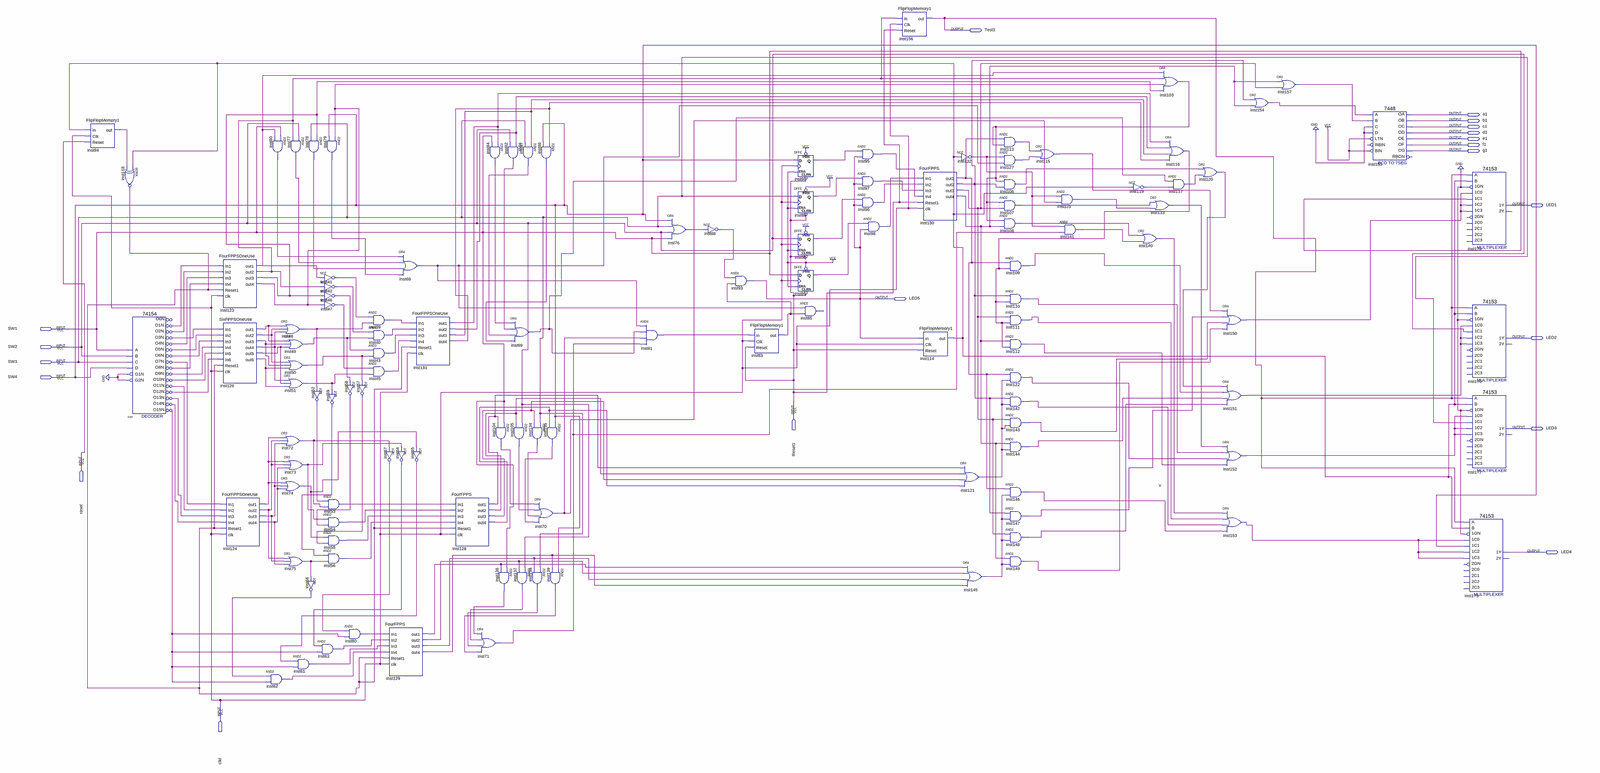
[diagram p0: schematic sheet, whole]
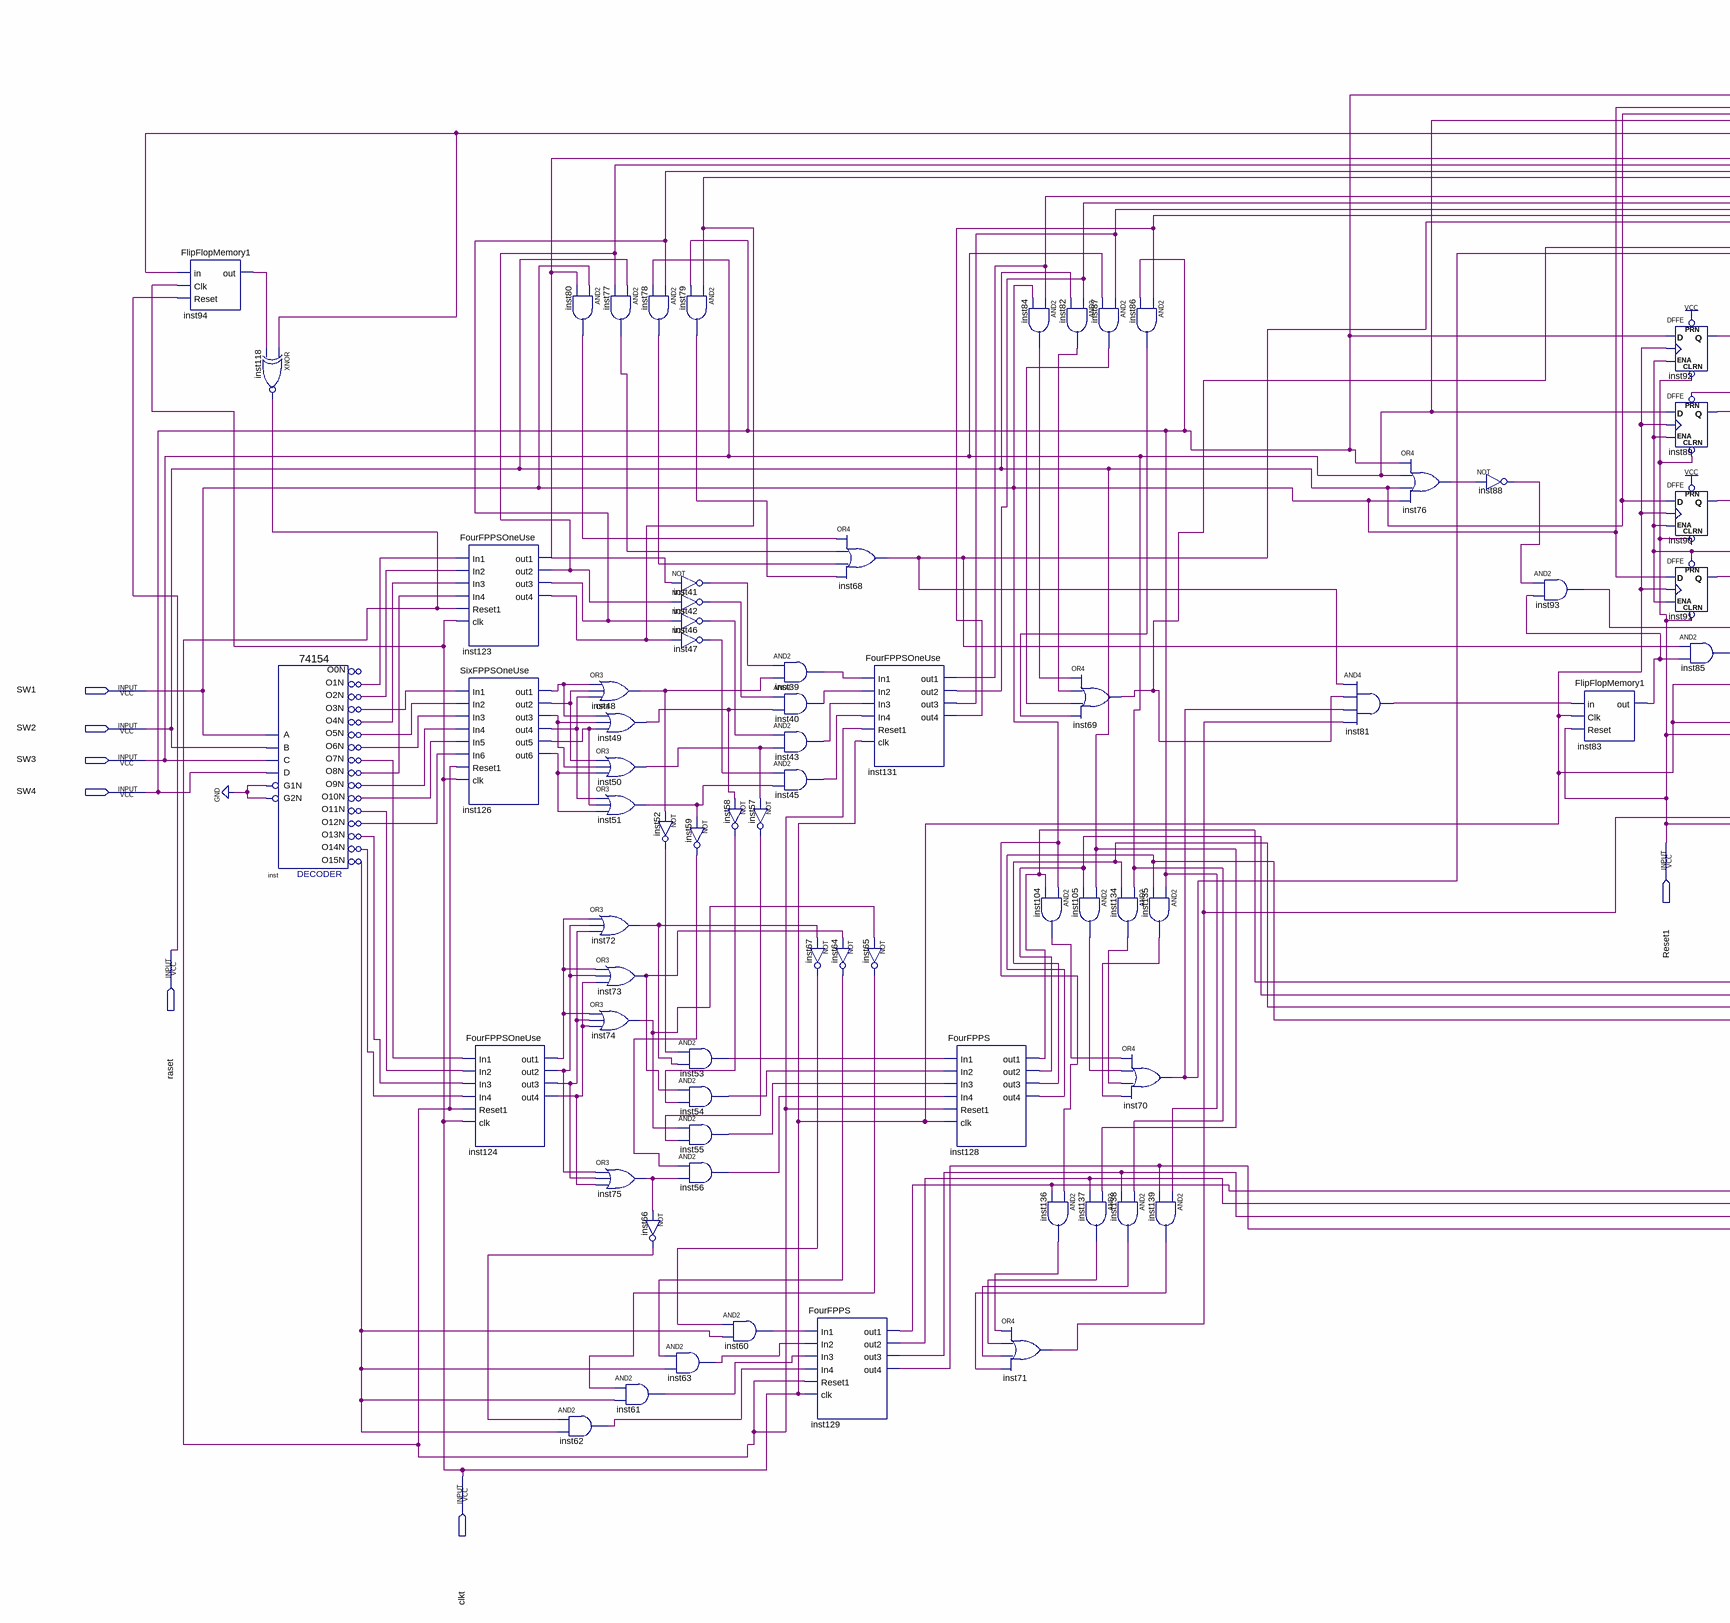
[diagram p1: schematic sheet, left part]
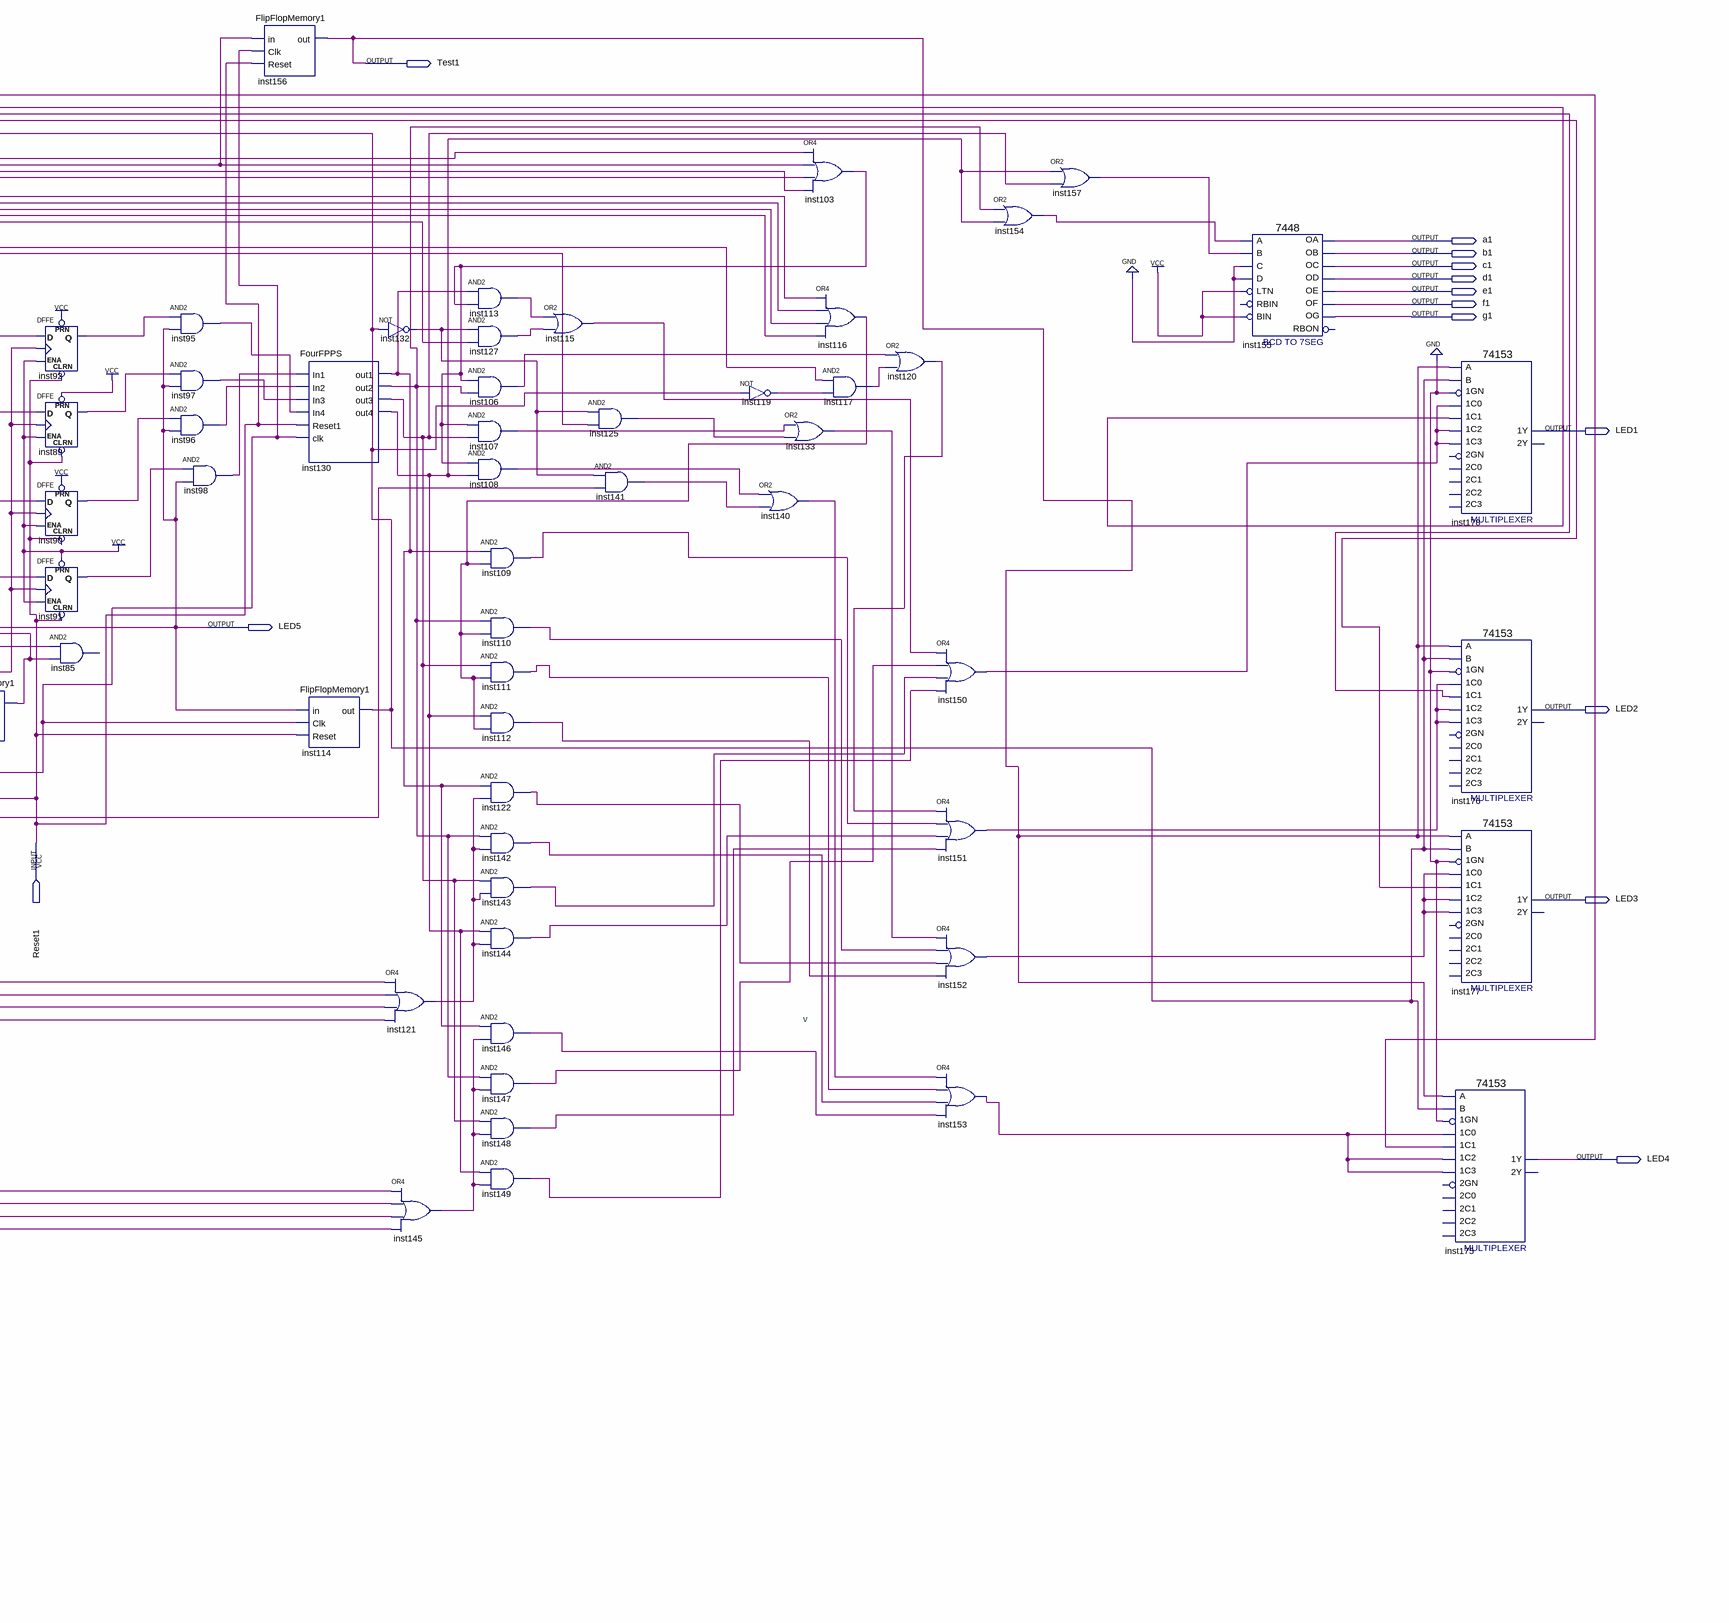
[diagram p2: schematic sheet, right part]
// Quartus schematic TR1.bdf as structural Verilog: 119 symbols, 20 pins
module TR1 (
  input  SW1,
  input  SW2,
  input  SW3,
  input  SW4,
  input  Reset1,
  input  raset,
  input  clkt,
  output Test1,
  output a1,
  output b1,
  output c1,
  output d1,
  output e1,
  output f1,
  output g1,
  output LED1,
  output LED5,
  output LED2,
  output LED3,
  output LED4
);

  wire inst39_out, inst40_out, inst41_out, inst42_out, inst43_out, inst45_out, inst46_out, inst47_out,
       inst48_out, inst49_out, inst50_out, inst51_out, inst52_out, inst53_out, inst54_out, inst55_out,
       inst56_out, inst57_out, inst58_out, inst59_out, inst60_out, inst61_out, inst62_out, inst63_out,
       inst64_out, inst65_out, inst66_out, inst67_out, inst68_out, inst69_out, inst70_out, inst71_out,
       inst72_out, inst73_out, inst74_out, inst75_out, inst76_out, inst77_out, inst78_out, inst79_out,
       inst80_out, inst81_out, inst82_out, inst83_out, inst84_out, inst86_out, inst87_out, inst88_out,
       inst89_q, inst90_q, inst91_q, inst92_q, inst94_out, inst95_out, inst96_out, inst97_out, inst98_out,
       inst103_out, inst104_out, inst105_out, inst106_out, inst107_out, inst108_out, inst109_out,
       inst110_out, inst111_out, inst112_out, inst113_out, inst114_out, inst115_out, inst116_out,
       inst117_out, inst118_out, inst119_out, inst120_out, inst121_out, inst122_out, inst123_out1,
       inst123_out2, inst123_out3, inst123_out4, inst124_out1, inst124_out2, inst124_out3, inst124_out4,
       inst125_out, inst126_out1, inst126_out2, inst126_out3, inst126_out4, inst126_out5, inst126_out6,
       inst127_out, inst128_out1, inst128_out2, inst128_out3, inst128_out4, inst129_out1, inst129_out2,
       inst129_out3, inst129_out4, inst130_out1, inst130_out2, inst130_out3, inst130_out4, inst131_out1,
       inst131_out2, inst131_out3, inst131_out4, inst132_out, inst133_out, inst134_out, inst135_out,
       inst136_out, inst137_out, inst138_out, inst139_out, inst140_out, inst141_out, inst142_out,
       inst143_out, inst144_out, inst145_out, inst146_out, inst147_out, inst148_out, inst149_out,
       inst150_out, inst151_out, inst152_out, inst153_out, inst154_out, inst157_out, inst_o1n,
       inst_O1N_inverted_out, inst_o2n, inst_O2N_inverted_out, inst_o3n, inst_O3N_inverted_out, inst_o4n,
       inst_O4N_inverted_out, inst_o5n, inst_O5N_inverted_out, inst_o6n, inst_O6N_inverted_out, inst_o7n,
       inst_O7N_inverted_out, inst_o8n, inst_O8N_inverted_out, inst_o9n, inst_O9N_inverted_out, inst_o10n,
       inst_O10N_inverted_out, inst_o11n, inst_O11N_inverted_out, inst_o12n, inst_O12N_inverted_out,
       inst_o13n, inst_O13N_inverted_out, inst_o14n, inst_O14N_inverted_out, inst_o15n,
       inst_O15N_inverted_out;

  FlipFlopMemory1 inst94 (.in(inst114_out), .Clk(clkt), .Reset(raset), .out(inst94_out));
  xnor inst118 (inst118_out, inst114_out, inst94_out);
  \74154  inst (
    .C(SW3), .D(SW4), .B(SW2), .A(SW1), .G1N(1'b0), .G2N(1'b0), .O12N(inst_o12n), .O15N(inst_o15n),
    .O10N(inst_o10n), .O11N(inst_o11n), .O1N(inst_o1n), .O13N(inst_o13n), .O14N(inst_o14n), .O4N(inst_o4n),
    .O3N(inst_o3n), .O2N(inst_o2n), .O7N(inst_o7n), .O6N(inst_o6n), .O5N(inst_o5n), .O9N(inst_o9n),
    .O8N(inst_o8n));  // open: O0N
  not inst_O12N_inverted (inst_O12N_inverted_out, inst_o12n);
  not inst_O15N_inverted (inst_O15N_inverted_out, inst_o15n);
  not inst_O10N_inverted (inst_O10N_inverted_out, inst_o10n);
  not inst_O11N_inverted (inst_O11N_inverted_out, inst_o11n);
  not inst_O1N_inverted (inst_O1N_inverted_out, inst_o1n);
  not inst_O13N_inverted (inst_O13N_inverted_out, inst_o13n);
  not inst_O14N_inverted (inst_O14N_inverted_out, inst_o14n);
  not inst_O4N_inverted (inst_O4N_inverted_out, inst_o4n);
  not inst_O3N_inverted (inst_O3N_inverted_out, inst_o3n);
  not inst_O2N_inverted (inst_O2N_inverted_out, inst_o2n);
  not inst_O7N_inverted (inst_O7N_inverted_out, inst_o7n);
  not inst_O6N_inverted (inst_O6N_inverted_out, inst_o6n);
  not inst_O5N_inverted (inst_O5N_inverted_out, inst_o5n);
  not inst_O9N_inverted (inst_O9N_inverted_out, inst_o9n);
  not inst_O8N_inverted (inst_O8N_inverted_out, inst_o8n);
  FourFPPSOneUse inst123 (
    .In1(inst_O1N_inverted_out), .In2(inst_O2N_inverted_out), .In3(inst_O4N_inverted_out),
    .In4(inst_O8N_inverted_out), .Reset1(inst118_out), .clk(clkt), .out1(inst123_out1), .out2(inst123_out2),
    .out3(inst123_out3), .out4(inst123_out4));
  SixFPPSOneUse inst126 (
    .In1(inst_O3N_inverted_out), .In2(inst_O5N_inverted_out), .In3(inst_O6N_inverted_out),
    .In4(inst_O9N_inverted_out), .In5(inst_O10N_inverted_out), .In6(inst_O12N_inverted_out),
    .Reset1(inst118_out), .clk(clkt), .out1(inst126_out1), .out2(inst126_out2), .out3(inst126_out3),
    .out4(inst126_out4), .out5(inst126_out5), .out6(inst126_out6));
  FourFPPSOneUse inst124 (
    .In1(inst_O7N_inverted_out), .In2(inst_O11N_inverted_out), .In3(inst_O13N_inverted_out),
    .In4(inst_O14N_inverted_out), .Reset1(inst118_out), .clk(clkt), .out1(inst124_out1), .out2(inst124_out2),
    .out3(inst124_out3), .out4(inst124_out4));
  and inst80 (inst80_out, SW1, inst123_out1);
  and inst62 (inst62_out, inst66_out, inst_O15N_inverted_out);
  and inst77 (inst77_out, SW2, inst123_out2);
  or inst48 (inst48_out, inst126_out1, inst126_out2, inst126_out4);
  or inst49 (inst49_out, inst126_out1, inst126_out3, inst126_out5);
  or inst50 (inst50_out, inst126_out2, inst126_out3, inst126_out6);
  or inst51 (inst51_out, inst126_out4, inst126_out5, inst126_out6);
  or inst72 (inst72_out, inst124_out1, inst124_out2, inst124_out3);
  or inst73 (inst73_out, inst124_out1, inst124_out2, inst124_out4);
  or inst74 (inst74_out, inst124_out1, inst124_out3, inst124_out4);
  or inst75 (inst75_out, inst124_out2, inst124_out3, inst124_out4);
  and inst61 (inst61_out, inst65_out, inst_O15N_inverted_out);
  and inst78 (inst78_out, inst123_out3, SW3);
  and inst79 (inst79_out, inst123_out4, SW4);
  not inst41 (inst41_out, inst123_out1);
  not inst42 (inst42_out, inst123_out2);
  not inst46 (inst46_out, inst123_out3);
  not inst47 (inst47_out, inst123_out4);
  not inst52 (inst52_out, inst48_out);
  and inst53 (inst53_out, inst52_out, inst72_out);
  and inst54 (inst54_out, inst73_out, inst58_out);
  and inst55 (inst55_out, inst74_out, inst57_out);
  and inst56 (inst56_out, inst59_out, inst75_out);
  not inst66 (inst66_out, inst75_out);
  and inst63 (inst63_out, inst64_out, inst_O15N_inverted_out);
  not inst58 (inst58_out, inst49_out);
  not inst59 (inst59_out, inst51_out);
  and inst60 (inst60_out, inst67_out, inst_O15N_inverted_out);
  and inst39 (inst39_out, inst41_out, inst48_out);
  and inst40 (inst40_out, inst42_out, inst49_out);
  and inst43 (inst43_out, inst46_out, inst50_out);
  and inst45 (inst45_out, inst47_out, inst51_out);
  not inst57 (inst57_out, inst50_out);
  not inst64 (inst64_out, inst73_out);
  not inst67 (inst67_out, inst72_out);
  FourFPPS inst129 (
    .In1(inst60_out), .In2(inst63_out), .In3(inst61_out), .In4(inst62_out), .Reset1(inst118_out), .clk(clkt),
    .out1(inst129_out1), .out2(inst129_out2), .out3(inst129_out3), .out4(inst129_out4));
  or inst68 (inst68_out, inst80_out, inst77_out, inst78_out, inst79_out);
  FourFPPSOneUse inst131 (
    .In1(inst39_out), .In2(inst40_out), .In3(inst43_out), .In4(inst45_out), .Reset1(inst118_out), .clk(clkt),
    .out1(inst131_out1), .out2(inst131_out2), .out3(inst131_out3), .out4(inst131_out4));
  not inst65 (inst65_out, inst74_out);
  FourFPPS inst128 (
    .In1(inst53_out), .In2(inst54_out), .In3(inst55_out), .In4(inst56_out), .Reset1(inst118_out), .clk(clkt),
    .out1(inst128_out1), .out2(inst128_out2), .out3(inst128_out3), .out4(inst128_out4));
  and inst84 (inst84_out, inst131_out1, SW1);
  and inst104 (inst104_out, SW1, inst128_out1);
  or inst71 (inst71_out, inst136_out, inst137_out, inst138_out, inst139_out);
  and inst82 (inst82_out, inst131_out2, SW2);
  or inst69 (inst69_out, inst84_out, inst82_out, inst87_out, inst86_out);
  and inst105 (inst105_out, SW2, inst128_out2);
  and inst136 (inst136_out, SW1, inst129_out1);
  and inst137 (inst137_out, SW2, inst129_out2);
  and inst86 (inst86_out, inst131_out4, SW4);
  and inst87 (inst87_out, inst131_out3, SW3);
  and inst134 (inst134_out, SW3, inst128_out3);
  or inst70 (inst70_out, inst104_out, inst105_out, inst134_out, inst135_out);
  and inst138 (inst138_out, SW3, inst129_out3);
  and inst135 (inst135_out, SW4, inst128_out4);
  and inst139 (inst139_out, SW4, inst129_out4);
  and inst81 (inst81_out, inst68_out, inst69_out, inst70_out, inst71_out);
  or inst76 (inst76_out, SW4, SW3, SW2, SW1);
  not inst88 (inst88_out, inst76_out);
  and inst93 (LED5, inst88_out, inst83_out);
  FlipFlopMemory1 inst83 (.in(inst81_out), .Clk(clkt), .Reset(Reset1), .out(inst83_out));
  DFFE inst92 (.PRN(1'b1), .CLRN(Reset1), .D(SW4), .CLK(clkt), .ENA(1'b1), .Q(inst92_q));
  DFFE inst89 (.PRN(1'b1), .CLRN(Reset1), .D(SW3), .CLK(clkt), .ENA(1'b1), .Q(inst89_q));
  DFFE inst90 (.PRN(1'b1), .CLRN(Reset1), .D(SW2), .CLK(clkt), .ENA(1'b1), .Q(inst90_q));
  DFFE inst91 (.PRN(1'b1), .CLRN(Reset1), .D(SW1), .CLK(clkt), .ENA(1'b1), .Q(inst91_q));
  // AND2 inst85 has open pins: IN1=inst68_out, IN2=inst83_out, OUT=open
  and inst95 (inst95_out, inst92_q, LED5);
  and inst97 (inst97_out, inst89_q, LED5);
  and inst96 (inst96_out, inst90_q, LED5);
  and inst98 (inst98_out, inst91_q, LED5);
  FlipFlopMemory1 inst156 (.in(inst123_out2), .Clk(clkt), .Reset(Reset1), .out(Test1));
  FourFPPS inst130 (
    .In1(inst98_out), .In2(inst96_out), .In3(inst97_out), .In4(inst95_out), .Reset1(Reset1), .clk(clkt),
    .out1(inst130_out1), .out2(inst130_out2), .out3(inst130_out3), .out4(inst130_out4));
  FlipFlopMemory1 inst114 (.in(LED5), .Clk(clkt), .Reset(Reset1), .out(inst114_out));
  not inst132 (inst132_out, inst114_out);
  or inst121 (inst121_out, inst128_out1, inst128_out2, inst128_out3, inst128_out4);
  or inst145 (inst145_out, inst129_out1, inst129_out2, inst129_out3, inst129_out4);
  and inst113 (inst113_out, inst130_out1, inst103_out);
  and inst127 (inst127_out, inst132_out, inst68_out);
  and inst106 (inst106_out, inst103_out, inst130_out2);
  and inst107 (inst107_out, inst103_out, inst130_out3);
  and inst108 (inst108_out, inst103_out, inst130_out4);
  and inst109 (inst109_out, inst130_out1, inst116_out);
  and inst110 (inst110_out, inst130_out2, inst116_out);
  and inst111 (inst111_out, inst130_out3, inst116_out);
  and inst112 (inst112_out, inst130_out4, inst116_out);
  and inst122 (inst122_out, inst130_out1, inst121_out);
  and inst142 (inst142_out, inst130_out2, inst121_out);
  and inst143 (inst143_out, inst130_out3, inst121_out);
  and inst144 (inst144_out, inst130_out4, inst121_out);
  and inst146 (inst146_out, inst130_out1, inst145_out);
  and inst147 (inst147_out, inst130_out2, inst145_out);
  and inst148 (inst148_out, inst130_out3, inst145_out);
  and inst149 (inst149_out, inst130_out4, inst145_out);
  or inst115 (inst115_out, inst113_out, inst127_out);
  and inst125 (inst125_out, inst132_out, inst70_out);
  and inst141 (inst141_out, inst132_out, inst71_out);
  not inst119 (inst119_out, inst114_out);
  or inst140 (inst140_out, inst108_out, inst141_out);
  or inst103 (inst103_out, inst123_out1, inst123_out2, inst123_out4, inst123_out3);
  or inst116 (inst116_out, inst131_out1, inst131_out2, inst131_out3, inst131_out4);
  and inst117 (inst117_out, inst69_out, inst119_out);
  or inst133 (inst133_out, inst107_out, inst125_out);
  or inst120 (inst120_out, inst106_out, inst117_out);
  or inst150 (inst150_out, inst115_out, inst147_out, inst143_out, inst149_out);
  or inst151 (inst151_out, inst120_out, inst109_out, inst144_out, inst148_out);
  or inst152 (inst152_out, inst133_out, inst110_out, inst122_out, inst112_out);
  or inst153 (inst153_out, inst140_out, inst111_out, inst142_out, inst146_out);
  or inst154 (inst154_out, inst130_out2, inst130_out4);
  or inst157 (inst157_out, inst130_out4, inst130_out3);
  \7448  inst155 (
    .A(inst154_out), .C(1'b0), .D(1'b0), .B(inst157_out), .BIN(1'b1), .LTN(1'b1), .OC(c1), .OE(e1), .OD(d1),
    .OF(f1), .OG(g1), .OB(b1), .OA(a1));  // open: RBIN, RBON
  \74153  inst178 (
    .\1C1 (SW1), .\1GN (1'b0), .\1C0 (inst150_out), .\1C2 (inst150_out), .\1C3 (inst150_out),
    .B(inst114_out), .A(Test1), .\1Y (LED1));  // open: 2C0, 2GN, 2C2, 2C1, 2C3, 2Y
  \74153  inst176 (
    .\1C1 (SW2), .\1GN (1'b0), .\1C0 (inst151_out), .\1C2 (inst151_out), .\1C3 (inst151_out),
    .B(inst114_out), .A(Test1), .\1Y (LED2));  // open: 2C0, 2GN, 2C2, 2C1, 2C3, 2Y
  \74153  inst177 (
    .\1C1 (SW3), .\1GN (1'b0), .\1C0 (inst152_out), .\1C2 (inst152_out), .\1C3 (inst152_out),
    .B(inst114_out), .A(Test1), .\1Y (LED3));  // open: 2C0, 2GN, 2C2, 2C1, 2C3, 2Y
  \74153  inst175 (
    .\1C1 (SW4), .\1GN (1'b0), .\1C0 (inst153_out), .\1C2 (inst153_out), .\1C3 (inst153_out),
    .B(inst114_out), .A(Test1), .\1Y (LED4));  // open: 2C0, 2GN, 2C2, 2C1, 2C3, 2Y

  // Notes on the sheet:
  //   v
endmodule
